# Altium project Time4CM4_Riser.PrjPcb
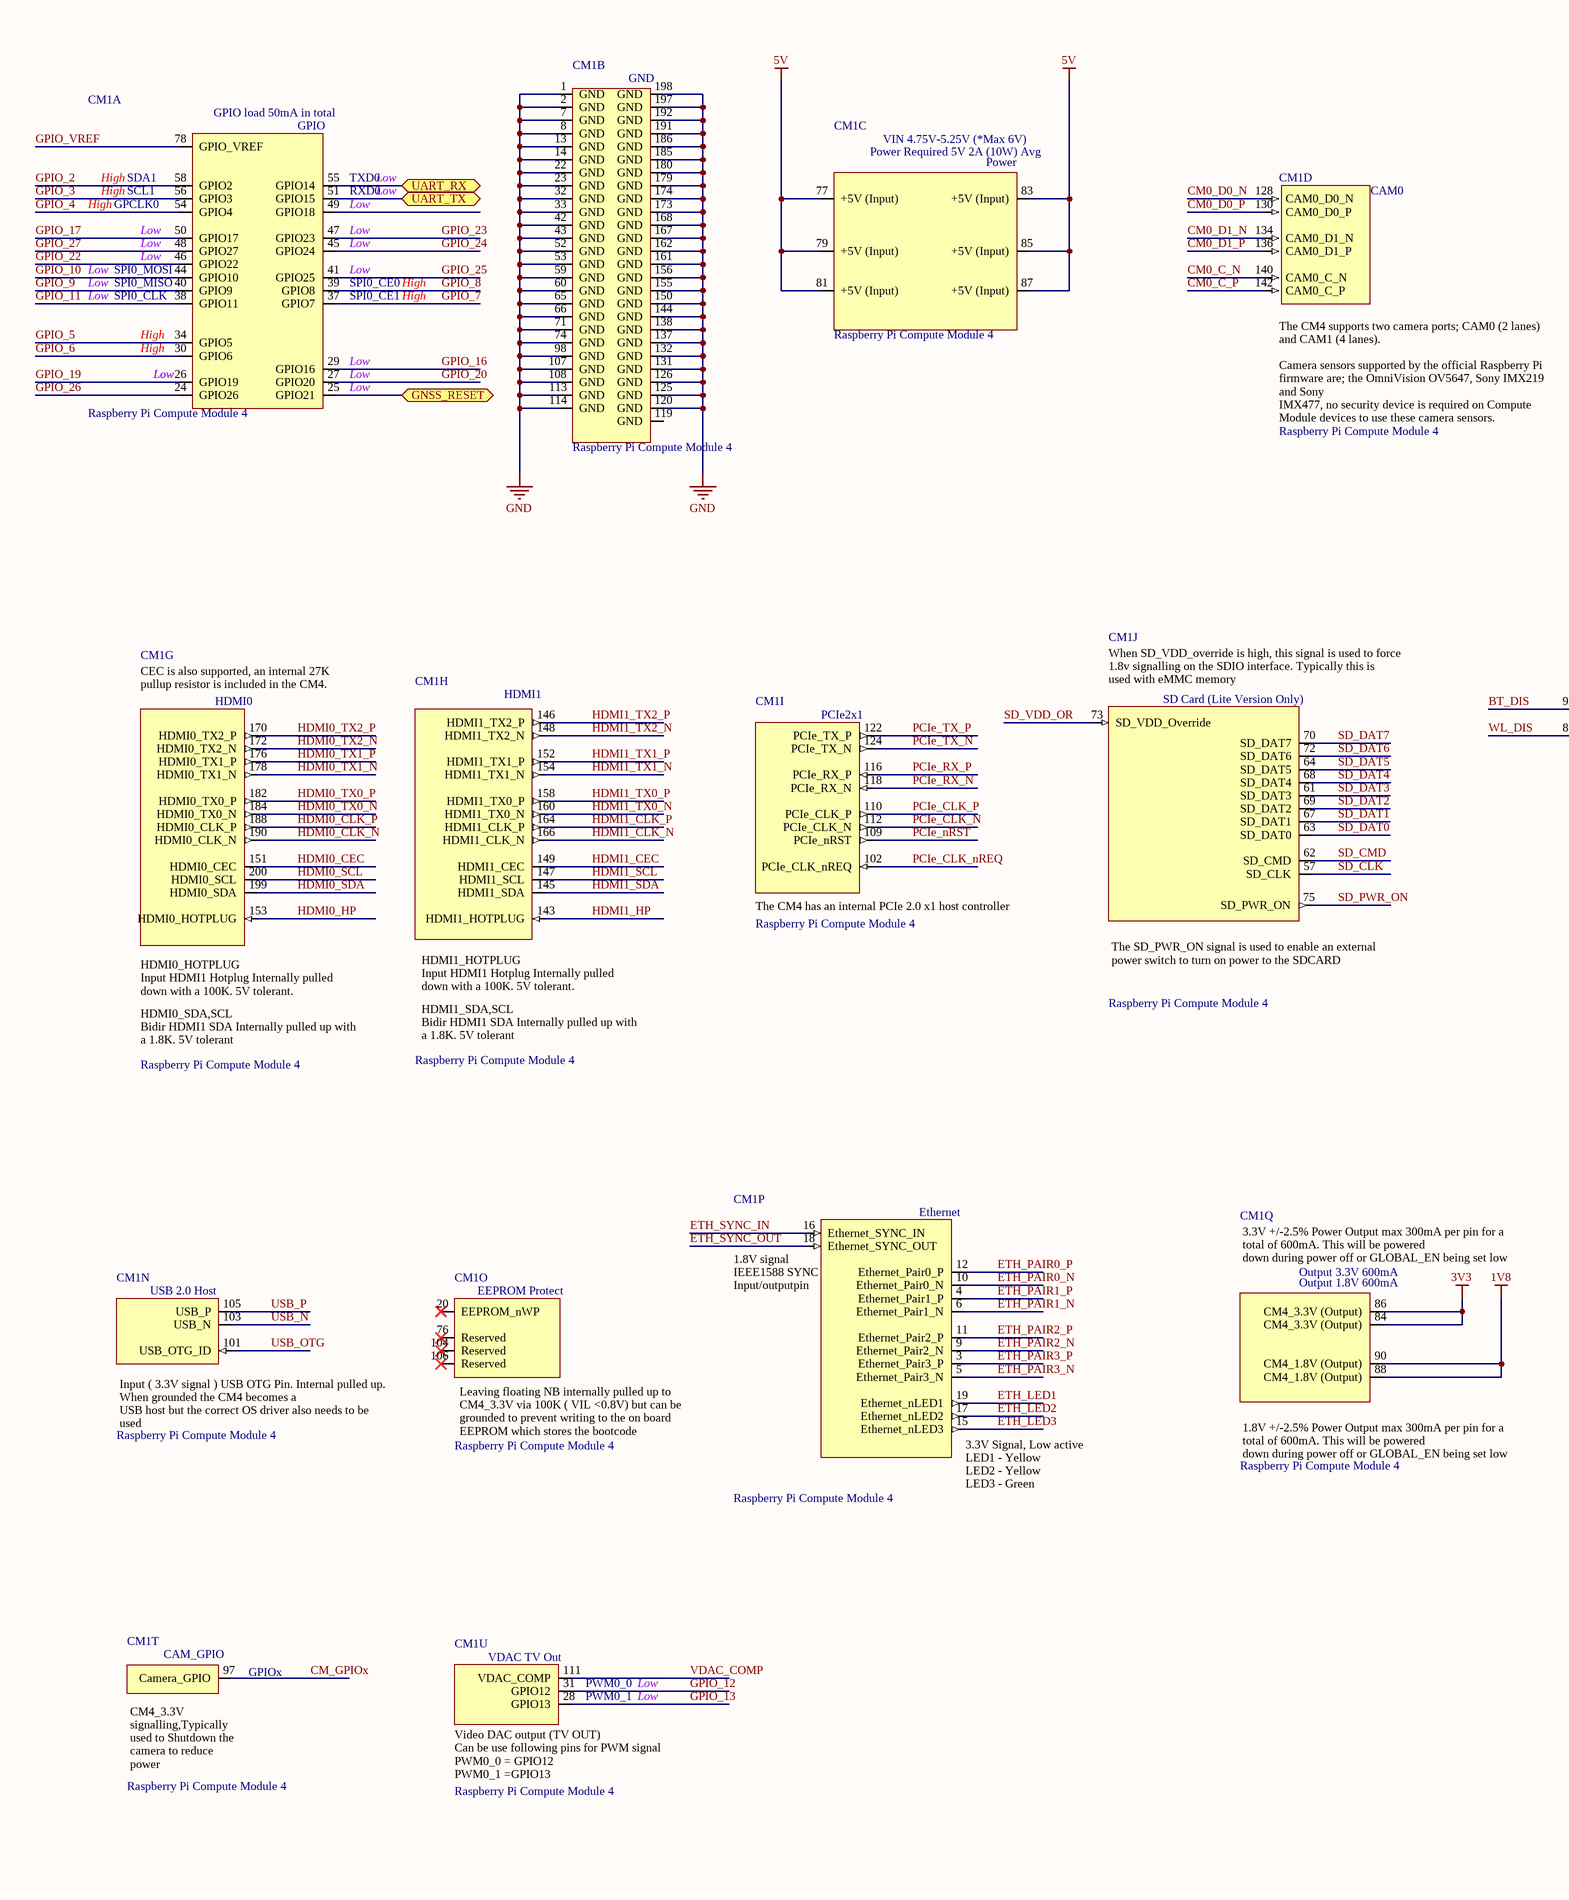
[diagram p0: CM4_IO_Conn.SchDoc, left]
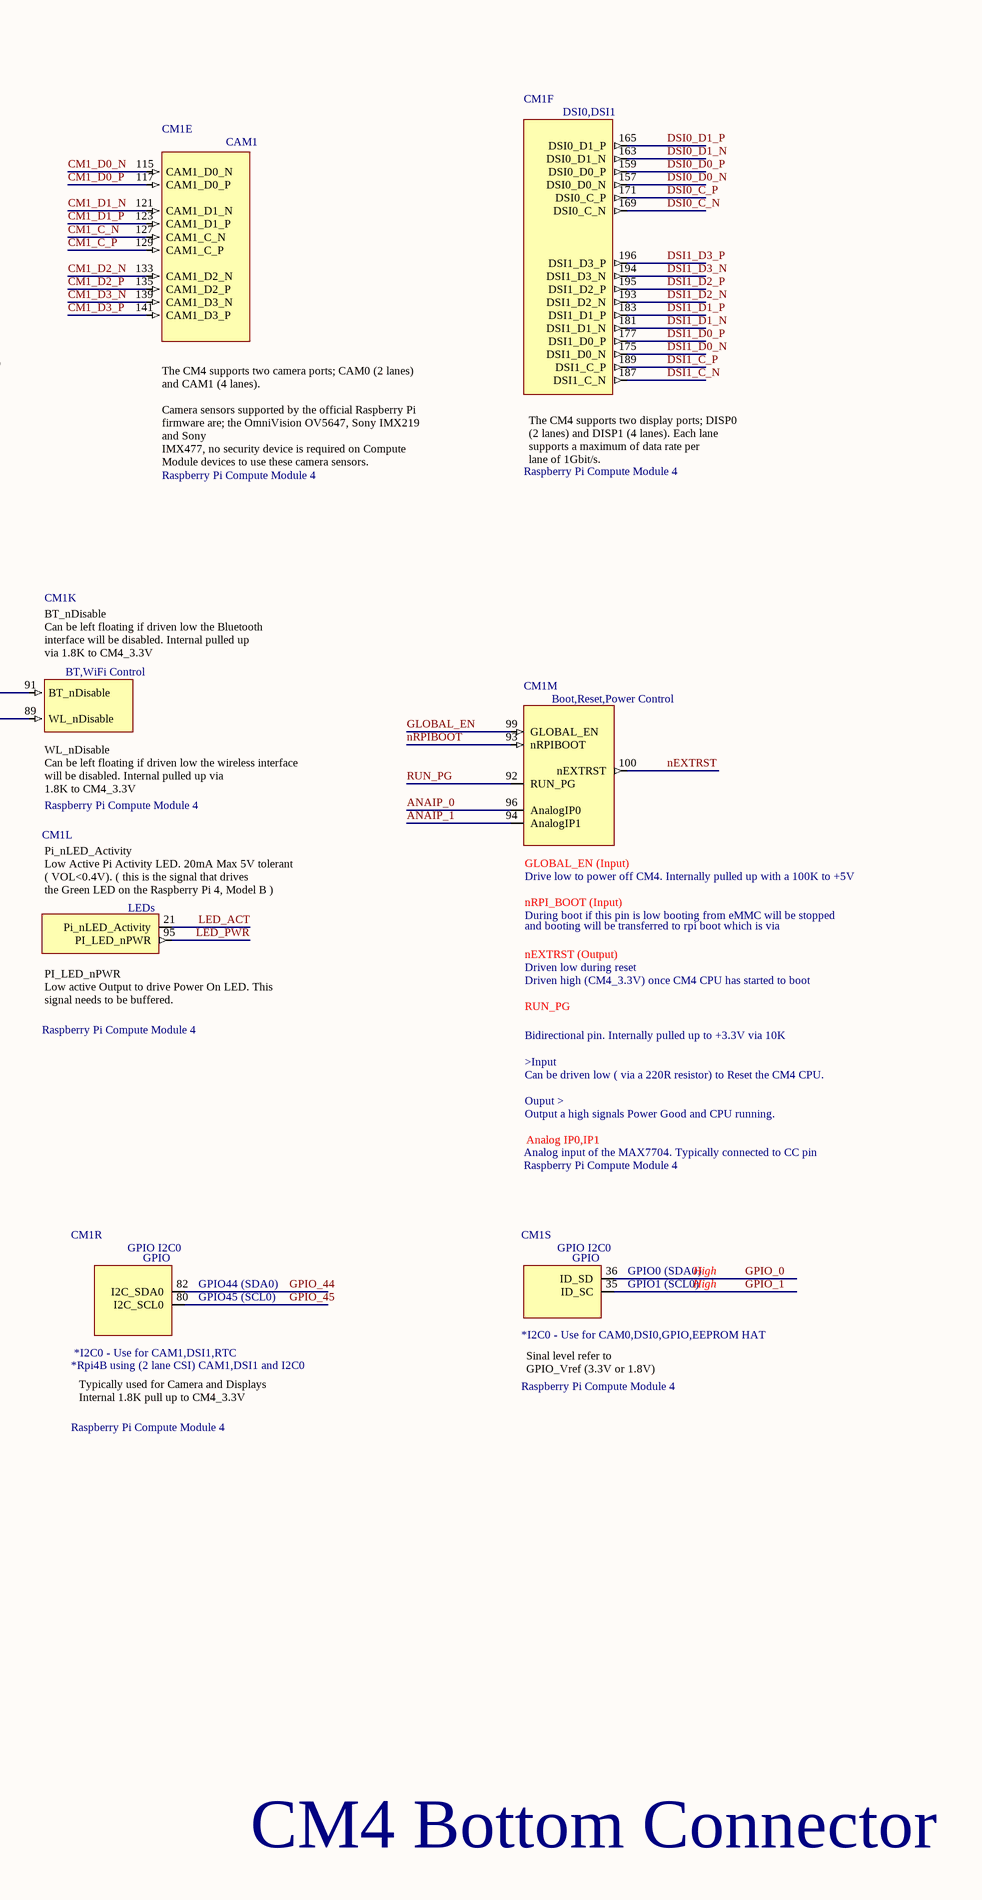
[diagram p1: CM4_IO_Conn.SchDoc, right]
1 sheet, 1 parts. Net scope: global (net labels, ports and power ports of the same name join across sheets).
Board file: Time4CM4_Riser.PcbDoc

## Sheet CM4_IO_Conn.SchDoc
size C; SheetNumber: 2; SheetTotal: 4

### Parts
CM1  Raspberry Pi Compute Module 4  [CM4-F40C-100DS-0.4v_1.5mm_0mm]  (parts A,B,C,D,E,F,G,H,I,J,K,L,M,N,O,P,Q,R,S,T,U of 21)  (no BOM)

### Ports
GNSS_RESET (bidir), UART_RX (bidir), UART_TX (bidir)

### Nets
1V8: CM1.88(CM4_1.8V_(Output)) CM1.90(CM4_1.8V_(Output))
3V3: CM1.84(CM4_3.3V_(Output)) CM1.86(CM4_3.3V_(Output))
5V: CM1.77(+5V_(Input)) CM1.79(+5V_(Input)) CM1.81(+5V_(Input)) CM1.83(+5V_(Input)) CM1.85(+5V_(Input)) CM1.87(+5V_(Input))
GND: CM1.1(GND) CM1.2(GND) CM1.7(GND) CM1.8(GND) CM1.13(GND) CM1.14(GND) CM1.22(GND) CM1.23(GND) CM1.32(GND) CM1.33(GND) CM1.42(GND) CM1.43(GND) CM1.52(GND) CM1.53(GND) CM1.59(GND) CM1.60(GND) CM1.65(GND) CM1.66(GND) CM1.71(GND) CM1.74(GND) CM1.98(GND) CM1.107(GND) CM1.108(GND) CM1.113(GND) CM1.114(GND) CM1.120(GND) CM1.125(GND) CM1.126(GND) CM1.131(GND) CM1.132(GND) CM1.137(GND) CM1.138(GND) CM1.144(GND) CM1.150(GND) CM1.155(GND) CM1.156(GND) CM1.161(GND) CM1.162(GND) CM1.167(GND) CM1.168(GND) CM1.173(GND) CM1.174(GND) CM1.179(GND) CM1.180(GND) CM1.185(GND) CM1.186(GND) CM1.191(GND) CM1.192(GND) CM1.197(GND) CM1.198(GND)
ANAIP_0: CM1.96(AnalogIP0)
ANAIP_1: CM1.94(AnalogIP1)
BT_DIS: CM1.91(BT_nDisable)
CM0_C_N: CM1.140(CAM0_C_N)
CM0_C_P: CM1.142(CAM0_C_P)
CM0_D0_N: CM1.128(CAM0_D0_N)
CM0_D0_P: CM1.130(CAM0_D0_P)
CM0_D1_N: CM1.134(CAM0_D1_N)
CM0_D1_P: CM1.136(CAM0_D1_P)
CM1_C_N: CM1.127(CAM1_C_N)
CM1_C_P: CM1.129(CAM1_C_P)
CM1_D0_N: CM1.115(CAM1_D0_N)
CM1_D0_P: CM1.117(CAM1_D0_P)
CM1_D1_N: CM1.121(CAM1_D1_N)
CM1_D1_P: CM1.123(CAM1_D1_P)
CM1_D2_N: CM1.133(CAM1_D2_N)
CM1_D2_P: CM1.135(CAM1_D2_P)
CM1_D3_N: CM1.139(CAM1_D3_N)
CM1_D3_P: CM1.141(CAM1_D3_P)
CM_GPIOx: CM1.97(Camera_GPIO)
DSI0_C_N: CM1.169(DSI0_C_N)
DSI0_C_P: CM1.171(DSI0_C_P)
DSI0_D0_N: CM1.157(DSI0_D0_N)
DSI0_D0_P: CM1.159(DSI0_D0_P)
DSI0_D1_N: CM1.163(DSI0_D1_N)
DSI0_D1_P: CM1.165(DSI0_D1_P)
DSI1_C_N: CM1.187(DSI1_C_N)
DSI1_C_P: CM1.189(DSI1_C_P)
DSI1_D0_N: CM1.175(DSI1_D0_N)
DSI1_D0_P: CM1.177(DSI1_D0_P)
DSI1_D1_N: CM1.181(DSI1_D1_N)
DSI1_D1_P: CM1.183(DSI1_D1_P)
DSI1_D2_N: CM1.193(DSI1_D2_N)
DSI1_D2_P: CM1.195(DSI1_D2_P)
DSI1_D3_N: CM1.194(DSI1_D3_N)
DSI1_D3_P: CM1.196(DSI1_D3_P)
ETH_LED1: CM1.19(Ethernet_nLED1)
ETH_LED2: CM1.17(Ethernet_nLED2)
ETH_LED3: CM1.15(Ethernet_nLED3)
ETH_PAIR0_N: CM1.10(Ethernet_Pair0_N)
ETH_PAIR0_P: CM1.12(Ethernet_Pair0_P)
ETH_PAIR1_N: CM1.6(Ethernet_Pair1_N)
ETH_PAIR1_P: CM1.4(Ethernet_Pair1_P)
ETH_PAIR2_N: CM1.9(Ethernet_Pair2_N)
ETH_PAIR2_P: CM1.11(Ethernet_Pair2_P)
ETH_PAIR3_N: CM1.5(Ethernet_Pair3_N)
ETH_PAIR3_P: CM1.3(Ethernet_Pair3_P)
ETH_SYNC_IN: CM1.16(Ethernet_SYNC_IN)
ETH_SYNC_OUT: CM1.18(Ethernet_SYNC_OUT)
GLOBAL_EN: CM1.99(GLOBAL_EN)
GPIO_0: CM1.36(ID_SD)
GPIO_1: CM1.35(ID_SC)
GPIO_2: CM1.58(GPIO2)
GPIO_3: CM1.56(GPIO3)
GPIO_4: CM1.54(GPIO4)
GPIO_5: CM1.34(GPIO5)
GPIO_6: CM1.30(GPIO6)
GPIO_7: CM1.37(GPIO7)
GPIO_8: CM1.39(GPIO8)
GPIO_9: CM1.40(GPIO9)
GPIO_10: CM1.44(GPIO10)
GPIO_11: CM1.38(GPIO11)
GPIO_12: CM1.31(GPIO12)
GPIO_13: CM1.28(GPIO13)
GPIO_16: CM1.29(GPIO16)
GPIO_17: CM1.50(GPIO17)
GPIO_19: CM1.26(GPIO19)
GPIO_20: CM1.27(GPIO20)
GPIO_22: CM1.46(GPIO22)
GPIO_23: CM1.47(GPIO23)
GPIO_24: CM1.45(GPIO24)
GPIO_25: CM1.41(GPIO25)
GPIO_26: CM1.24(GPIO26)
GPIO_27: CM1.48(GPIO27)
GPIO_44: CM1.82(I2C_SDA0)
GPIO_45: CM1.80(I2C_SCL0)
GPIO_VREF: CM1.78(GPIO_VREF)
HDMI0_CEC: CM1.151(HDMI0_CEC)
HDMI0_CLK_N: CM1.190(HDMI0_CLK_N)
HDMI0_CLK_P: CM1.188(HDMI0_CLK_P)
HDMI0_HP: CM1.153(HDMI0_HOTPLUG)
HDMI0_SCL: CM1.200(HDMI0_SCL)
HDMI0_SDA: CM1.199(HDMI0_SDA)
HDMI0_TX0_N: CM1.184(HDMI0_TX0_N)
HDMI0_TX0_P: CM1.182(HDMI0_TX0_P)
HDMI0_TX1_N: CM1.178(HDMI0_TX1_N)
HDMI0_TX1_P: CM1.176(HDMI0_TX1_P)
HDMI0_TX2_N: CM1.172(HDMI0_TX2_N)
HDMI0_TX2_P: CM1.170(HDMI0_TX2_P)
HDMI1_CEC: CM1.149(HDMI1_CEC)
HDMI1_CLK_N: CM1.166(HDMI1_CLK_N)
HDMI1_CLK_P: CM1.164(HDMI1_CLK_P)
HDMI1_HP: CM1.143(HDMI1_HOTPLUG)
HDMI1_SCL: CM1.147(HDMI1_SCL)
HDMI1_SDA: CM1.145(HDMI1_SDA)
HDMI1_TX0_N: CM1.160(HDMI1_TX0_N)
HDMI1_TX0_P: CM1.158(HDMI1_TX0_P)
HDMI1_TX1_N: CM1.154(HDMI1_TX1_N)
HDMI1_TX1_P: CM1.152(HDMI1_TX1_P)
HDMI1_TX2_N: CM1.148(HDMI1_TX2_N)
HDMI1_TX2_P: CM1.146(HDMI1_TX2_P)
LED_ACT: CM1.21(Pi_nLED_Activity)
LED_PWR: CM1.95(PI_LED_nPWR)
nEXTRST: CM1.100(nEXTRST)
nRPIBOOT: CM1.93(nRPIBOOT)
PCIe_CLK_N: CM1.112(PCIe_CLK_N)
PCIe_CLK_nREQ: CM1.102(PCIe_CLK_nREQ)
PCIe_CLK_P: CM1.110(PCIe_CLK_P)
PCIe_nRST: CM1.109(PCIe_nRST)
PCIe_RX_N: CM1.118(PCIe_RX_N)
PCIe_RX_P: CM1.116(PCIe_RX_P)
PCIe_TX_N: CM1.124(PCIe_TX_N)
PCIe_TX_P: CM1.122(PCIe_TX_P)
RUN_PG: CM1.92(RUN_PG)
SD_CLK: CM1.57(SD_CLK)
SD_CMD: CM1.62(SD_CMD)
SD_DAT0: CM1.63(SD_DAT0)
SD_DAT1: CM1.67(SD_DAT1)
SD_DAT2: CM1.69(SD_DAT2)
SD_DAT3: CM1.61(SD_DAT3)
SD_DAT4: CM1.68(SD_DAT4)
SD_DAT5: CM1.64(SD_DAT5)
SD_DAT6: CM1.72(SD_DAT6)
SD_DAT7: CM1.70(SD_DAT7)
SD_PWR_ON: CM1.75(SD_PWR_ON)
SD_VDD_OR: CM1.73(SD_VDD_Override)
USB_N: CM1.103(USB_N)
USB_OTG: CM1.101(USB_OTG_ID)
USB_P: CM1.105(USB_P)
VDAC_COMP: CM1.111(VDAC_COMP)
WL_DIS: CM1.89(WL_nDisable)
NetCM1_25: CM1.25(GPIO21) ; port GNSS_RESET
NetCM1_51: CM1.51(GPIO15) ; port UART_TX
NetCM1_55: CM1.55(GPIO14) ; port UART_RX

Not connected (* = marked no-connect by the designer): CM1 20(EEPROM_nWP)* 49(GPIO18) 76(Reserved)* 104(Reserved)* 106(Reserved)* 119(GND)

### Notes on the sheet
- CM4 Bottom Connector
- (in symbol CM4, part A) GPIO load 50mA in total; GPIO; High; SDA1; TXD0; Low; SCL1; RXD0; GPCLK0; SPI0_MOSI; SPI0_MISO; SPI0_CE0; SPI0_CLK; SPI0_CE1; by Amornthep Phunsin
- (in symbol CM4, part C) VIN 4.75V-5.25V (*Max 6V); Power Required 5V 2A (10W) Avg; Power; by Amornthep Phunsin
- (in symbol CM4, part D) CAM0; The CM4 supports two camera ports; CAM0 (2 lanes) and CAM1 (4 lanes). / Camera sensors supported by the official Raspberry Pi firmware are; the OmniVision OV5647, Sony IMX219 and Sony / IMX477, no security device is required on Compute Module devices to use these camera sensors.
- (in symbol CM4, part E) CAM1; The CM4 supports two camera ports; CAM0 (2 lanes) and CAM1 (4 lanes). / Camera sensors supported by the official Raspberry Pi firmware are; the OmniVision OV5647, Sony IMX219 and Sony / IMX477, no security device is required on Compute Module devices to use these camera sensors.
- (in symbol CM4, part F) DSI0,DSI1; The CM4 supports two display ports; DISP0 (2 lanes) and DISP1 (4 lanes). Each lane supports a maximum of data rate per / lane of 1Gbit/s.
- (in symbol CM4, part G) HDMI0; CEC is also supported, an internal 27K pullup resistor is included in the CM4.; HDMI0_HOTPLUG / Input HDMI1 Hotplug Internally pulled down with a 100K. 5V tolerant.; HDMI0_SDA,SCL / Bidir HDMI1 SDA Internally pulled up with a 1.8K. 5V tolerant
- (in symbol CM4, part H) HDMI1; HDMI1_HOTPLUG / Input HDMI1 Hotplug Internally pulled down with a 100K. 5V tolerant.; HDMI1_SDA,SCL / Bidir HDMI1 SDA Internally pulled up with a 1.8K. 5V tolerant
- (in symbol CM4, part I) PCIe2x1; The CM4 has an internal PCIe 2.0 x1 host controller
- (in symbol CM4, part J) When SD_VDD_override is high, this signal is used to force 1.8v signalling on the SDIO interface. Typically this is / used with eMMC memory; SD Card (Lite Version Only); by Amornthep Phunsin; The SD_PWR_ON signal is used to enable an external power switch to turn on power to the SDCARD
- (in symbol CM4, part K) BT_nDisable / Can be left floating if driven low the Bluetooth interface will be disabled. Internal pulled up / via 1.8K to CM4_3.3V; BT,WiFi Control; WL_nDisable / Can be left floating if driven low the wireless interface will be disabled. Internal pulled up via / 1.8K to CM4_3.3V
- (in symbol CM4, part L) Pi_nLED_Activity / Low Active Pi Activity LED. 20mA Max 5V tolerant ( VOL<0.4V). ( this is the signal that drives / the Green LED on the Raspberry Pi 4, Model B ); LEDs; PI_LED_nPWR / Low active Output to drive Power On LED. This signal needs to be buffered.
- (in symbol CM4, part M) Boot,Reset,Power Control; GLOBAL_EN (Input); Drive low to power off CM4. Internally pulled up with a 100K to +5V; nRPI_BOOT (Input); During boot if this pin is low booting from eMMC will be stopped; and booting will be transferred to rpi boot which is via; nEXTRST (Output); Driven low during reset; Driven high (CM4_3.3V) once CM4 CPU has started to boot; Bidirectional pin. Internally pulled up to +3.3V via 10K / >Input / Can be driven low ( via a 220R resistor) to Reset the CM4 CPU. / Ouput > / Output a high signals Power Good and CPU running.; Analog IP0,IP1; Analog input of the MAX7704. Typically connected to CC pin
- (in symbol CM4, part N) USB 2.0 Host; Input ( 3.3V signal ) USB OTG Pin. Internal pulled up. When grounded the CM4 becomes a / USB host but the correct OS driver also needs to be used
- (in symbol CM4, part O) EEPROM Protect; Leaving floating NB internally pulled up to CM4_3.3V via 100K ( VIL <0.8V) but can be / grounded to prevent writing to the on board EEPROM which stores the bootcode
- (in symbol CM4, part P) Ethernet; 1.8V signal / IEEE1588 SYNC Input/outputpin; by Amornthep Phunsin; 3.3V Signal, Low active / LED1 - Yellow / LED2 - Yellow / LED3 - Green
- (in symbol CM4, part Q) 3.3V +/-2.5% Power Output max 300mA per pin for a total of 600mA. This will be powered / down during power off or GLOBAL_EN being set low; Output 3.3V 600mA; Output 1.8V 600mA; 1.8V +/-2.5% Power Output max 300mA per pin for a total of 600mA. This will be powered / down during power off or GLOBAL_EN being set low
- (in symbol CM4, part R) GPIO I2C0; GPIO; GPIO44 (SDA0); GPIO45 (SCL0); *I2C0 - Use for CAM1,DSI1,RTC; *Rpi4B using (2 lane CSI) CAM1,DSI1 and I2C0; Typically used for Camera and Displays Internal 1.8K pull up to CM4_3.3V
- (in symbol CM4, part S) GPIO I2C0; GPIO; GPIO0 (SDA0); High; GPIO1 (SCL0); *I2C0 - Use for CAM0,DSI0,GPIO,EEPROM HAT; Sinal level refer to  GPIO_Vref (3.3V or 1.8V)
- (in symbol CM4, part T) CAM_GPIO; GPIOx; CM4_3.3V signalling,Typically used to Shutdown the camera to reduce power
- (in symbol CM4, part U) VDAC TV Out; PWM0_0; Low; PWM0_1; Video DAC output (TV OUT) / Can be use following pins for PWM signal / PWM0_0 = GPIO12 / PWM0_1 =GPIO13

### Library data of the parts
CM1 = CM4: Raspberry Pi Compute Module 4 by Amornthep Phunsin